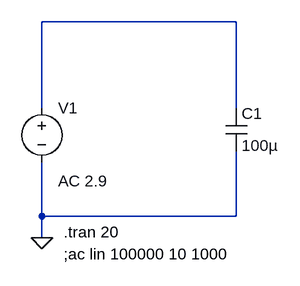
[diagram p0: schematic lab2_capacitor.asc]
lab2_capacitor.asc, the LTspice schematic file:
Version 4
SHEET 1 880 680
WIRE 528 80 240 80
WIRE 240 208 240 80
WIRE 528 208 528 80
WIRE 240 368 240 288
WIRE 528 368 528 272
WIRE 528 368 240 368
WIRE 240 400 240 368
FLAG 240 400 0
SYMBOL voltage 240 192 R0
WINDOW 123 24 124 Left 2
WINDOW 39 0 0 Left 0
WINDOW 3 24 96 Invisible 2
SYMATTR Value2 AC 2.9
SYMATTR InstName V1
SYMATTR Value SINE(0 2.9 10)
SYMBOL cap 512 208 R0
SYMATTR InstName C1
SYMATTR Value 100µ
TEXT 272 392 Left 2 !.tran 20
TEXT 272 424 Left 2 !;ac lin 100000 10 1000

The netlist it stands for:
* lab2_capacitor.asc
V1 N001 0 SINE(0 2.9 10) AC 2.9
C1 N001 0 100µ
.tran 20
;ac lin 100000 10 1000
.backanno
.end